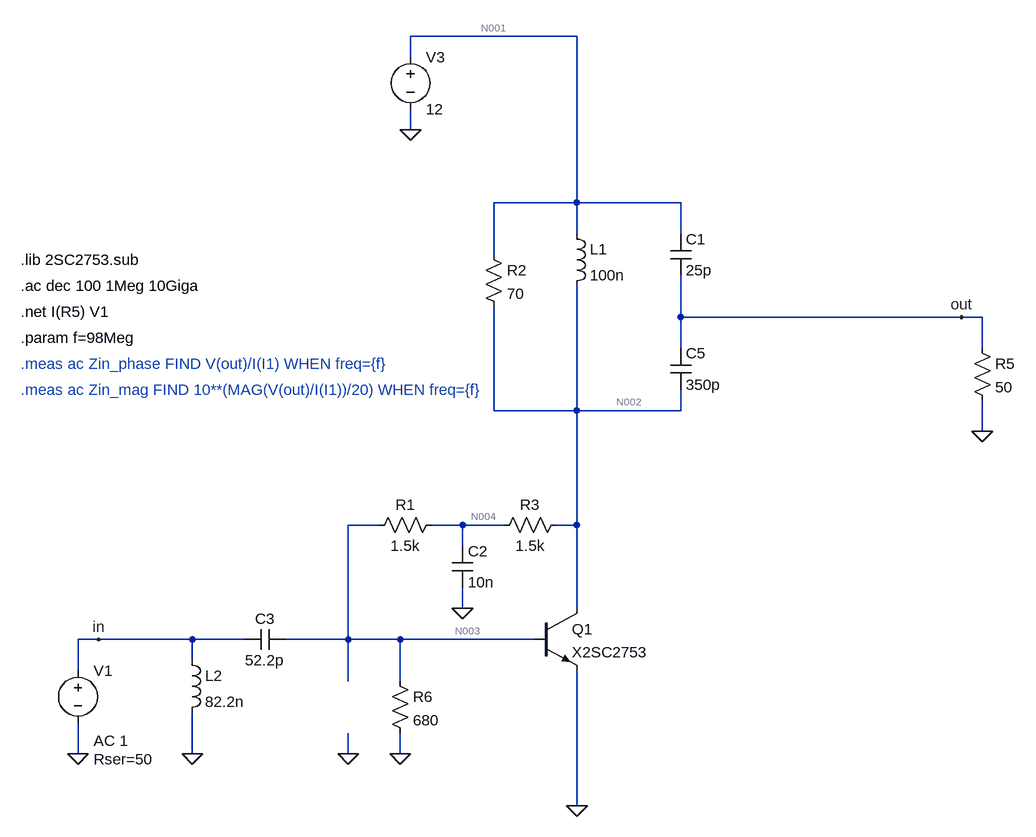
[diagram p0: schematic narrowband.asc]
narrowband.asc, the LTspice schematic file:
Version 4
SHEET 1 1396 680
WIRE 256 -656 0 -656
WIRE 0 -624 0 -656
WIRE 0 -512 0 -544
WIRE 256 -400 256 -656
WIRE 256 -400 128 -400
WIRE 416 -400 256 -400
WIRE 256 -352 256 -400
WIRE 416 -352 416 -400
WIRE 128 -320 128 -400
WIRE 416 -224 416 -288
WIRE 848 -224 416 -224
WIRE 880 -224 848 -224
WIRE 416 -176 416 -224
WIRE 880 -176 880 -224
WIRE 128 -80 128 -240
WIRE 256 -80 256 -272
WIRE 256 -80 128 -80
WIRE 416 -80 416 -112
WIRE 416 -80 256 -80
WIRE 880 -48 880 -96
WIRE -48 96 -96 96
WIRE 80 96 32 96
WIRE 144 96 80 96
WIRE 256 96 256 -80
WIRE 256 96 224 96
WIRE 80 128 80 96
WIRE 80 224 80 192
WIRE 256 224 256 96
WIRE -480 272 -512 272
WIRE -336 272 -480 272
WIRE -256 272 -336 272
WIRE -96 272 -96 96
WIRE -96 272 -192 272
WIRE -16 272 -96 272
WIRE 192 272 -16 272
WIRE -336 304 -336 272
WIRE -512 320 -512 272
WIRE -96 336 -96 272
WIRE -16 336 -16 272
WIRE -512 448 -512 400
WIRE -336 448 -336 384
WIRE -96 448 -96 416
WIRE -16 448 -16 416
WIRE 256 528 256 320
FLAG 256 528 0
FLAG -512 448 0
FLAG 0 -512 0
FLAG -16 448 0
FLAG -480 272 in
FLAG 80 224 0
FLAG 880 -48 0
FLAG 848 -224 out
FLAG -336 448 0
FLAG -96 448 0
SYMBOL ind 240 -368 R0
SYMATTR InstName L1
SYMATTR Value 100n
SYMBOL cap 400 -352 R0
SYMATTR InstName C1
SYMATTR Value 25p
SYMBOL npn 192 224 R0
SYMATTR InstName Q1
SYMATTR Value X2SC2753
SYMATTR Prefix X1
SYMBOL voltage 0 -640 R0
WINDOW 123 0 0 Left 0
WINDOW 39 0 0 Left 0
SYMATTR InstName V3
SYMATTR Value 12
SYMBOL res -32 320 R0
SYMATTR InstName R6
SYMATTR Value 680
SYMBOL res 112 -336 R0
SYMATTR InstName R2
SYMATTR Value 70
SYMBOL res 48 80 R90
WINDOW 0 0 56 VBottom 2
WINDOW 3 32 56 VTop 2
SYMATTR InstName R1
SYMATTR Value 1.5k
SYMBOL res 240 80 R90
WINDOW 0 0 56 VBottom 2
WINDOW 3 32 56 VTop 2
SYMATTR InstName R3
SYMATTR Value 1.5k
SYMBOL cap 64 128 R0
SYMATTR InstName C2
SYMATTR Value 10n
SYMBOL cap -192 256 R90
WINDOW 0 0 32 VBottom 2
WINDOW 3 32 32 VTop 2
SYMATTR InstName C3
SYMATTR Value 52.2p
SYMBOL ind -352 288 R0
SYMATTR InstName L2
SYMATTR Value 82.2n
SYMBOL voltage -512 304 R0
WINDOW 123 24 124 Left 2
WINDOW 39 24 152 Left 2
SYMATTR InstName V1
SYMATTR Value ""
SYMATTR Value2 AC 1
SYMATTR SpiceLine Rser=50
SYMBOL cap 400 -176 R0
SYMATTR InstName C5
SYMATTR Value 350p
SYMBOL res 864 -192 R0
SYMATTR InstName R5
SYMATTR Value 50
TEXT -600 -312 Left 2 !.lib 2SC2753.sub
TEXT -600 -272 Left 2 !.ac dec 100 1Meg 10Giga
TEXT -600 -232 Left 2 !.net I(R5) V1
TEXT -600 -112 Left 2 ;.meas ac Zin_mag FIND 10**(MAG(V(out)/I(I1))/20) WHEN freq={f}
TEXT -600 -152 Left 2 ;.meas ac Zin_phase FIND V(out)/I(I1) WHEN freq={f}
TEXT -600 -192 Left 2 !.param f=98Meg

The netlist it stands for:
* narrowband.asc
L1 N001 N002 100n
C1 N001 out 25p
XQ1 N002 N003 0 X2SC2753  ; pins C B E
V3 N001 0 12
R6 N003 0 680
R2 N001 N002 70
R1 N004 N003 1.5k
R3 N002 N004 1.5k
C2 N004 0 10n
C3 N003 in 52.2p
L2 in 0 82.2n
V1 in 0 AC 1 Rser=50
C5 out N002 350p
R5 out 0 50
.lib 2SC2753.sub
.ac dec 100 1Meg 10Giga
.net I(R5) V1
* .meas ac Zin_mag FIND 10**(MAG(V(out)/I(I1))/20) WHEN freq={f}
* .meas ac Zin_phase FIND V(out)/I(I1) WHEN freq={f}
.param f=98Meg
.backanno
.end

* Results of the author's LTspice run, read from the files saved beside the schematic
* Operating Point, zero values left out:
*   V(n001) = 12 V
*   V(n002) = 12 V
*   V(n003) = 920.4 mV
*   V(n004) = 6.46 V
*   I(L1) = 166.2 mA
*   I(R3) = 3.693 mA
*   I(R1) = 3.693 mA
*   I(R2) = 2.375 µA
*   I(R6) = 1.354 mA
*   I(V3) = -166.2 mA
*   Ix(q1:C1) = 162.5 mA
*   Ix(q1:B1) = 2.34 mA
*   Ix(q1:E1) = -164.9 mA
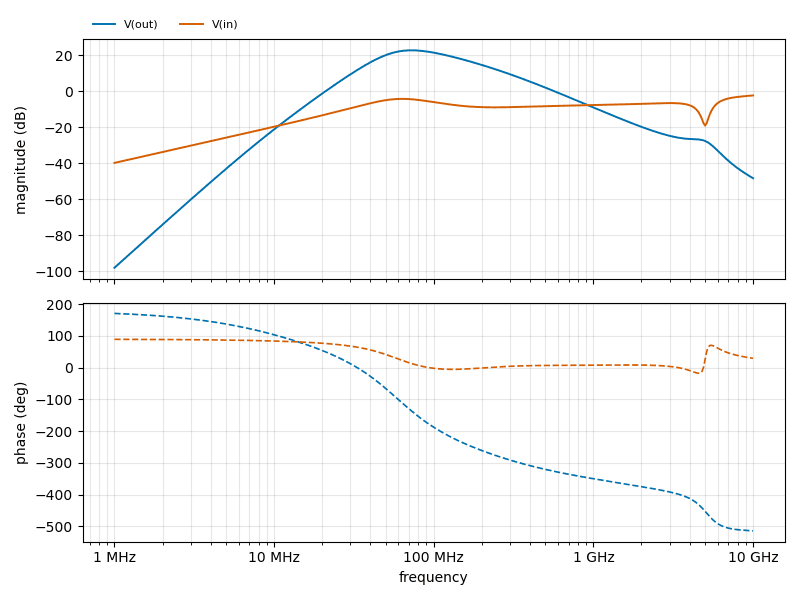
[diagram p1: AC Analysis of narrowband.asc, plotted from the saved traces]
* AC Analysis, 1 run:
*   V(out): -97.93 dB at 1 MHz, -48.21 dB at 10 GHz, peak 22.81 dB at 72.44 MHz, 3 dB below the peak at 48.91 MHz and 123.1 MHz
*   V(in): -39.72 dB at 1 MHz, -2.27 dB at 10 GHz, peak -2.27 dB at 10 GHz, 3 dB below the peak at 6.322 GHz